# Altium project PDM Mk21 - Mini.PrjPCB
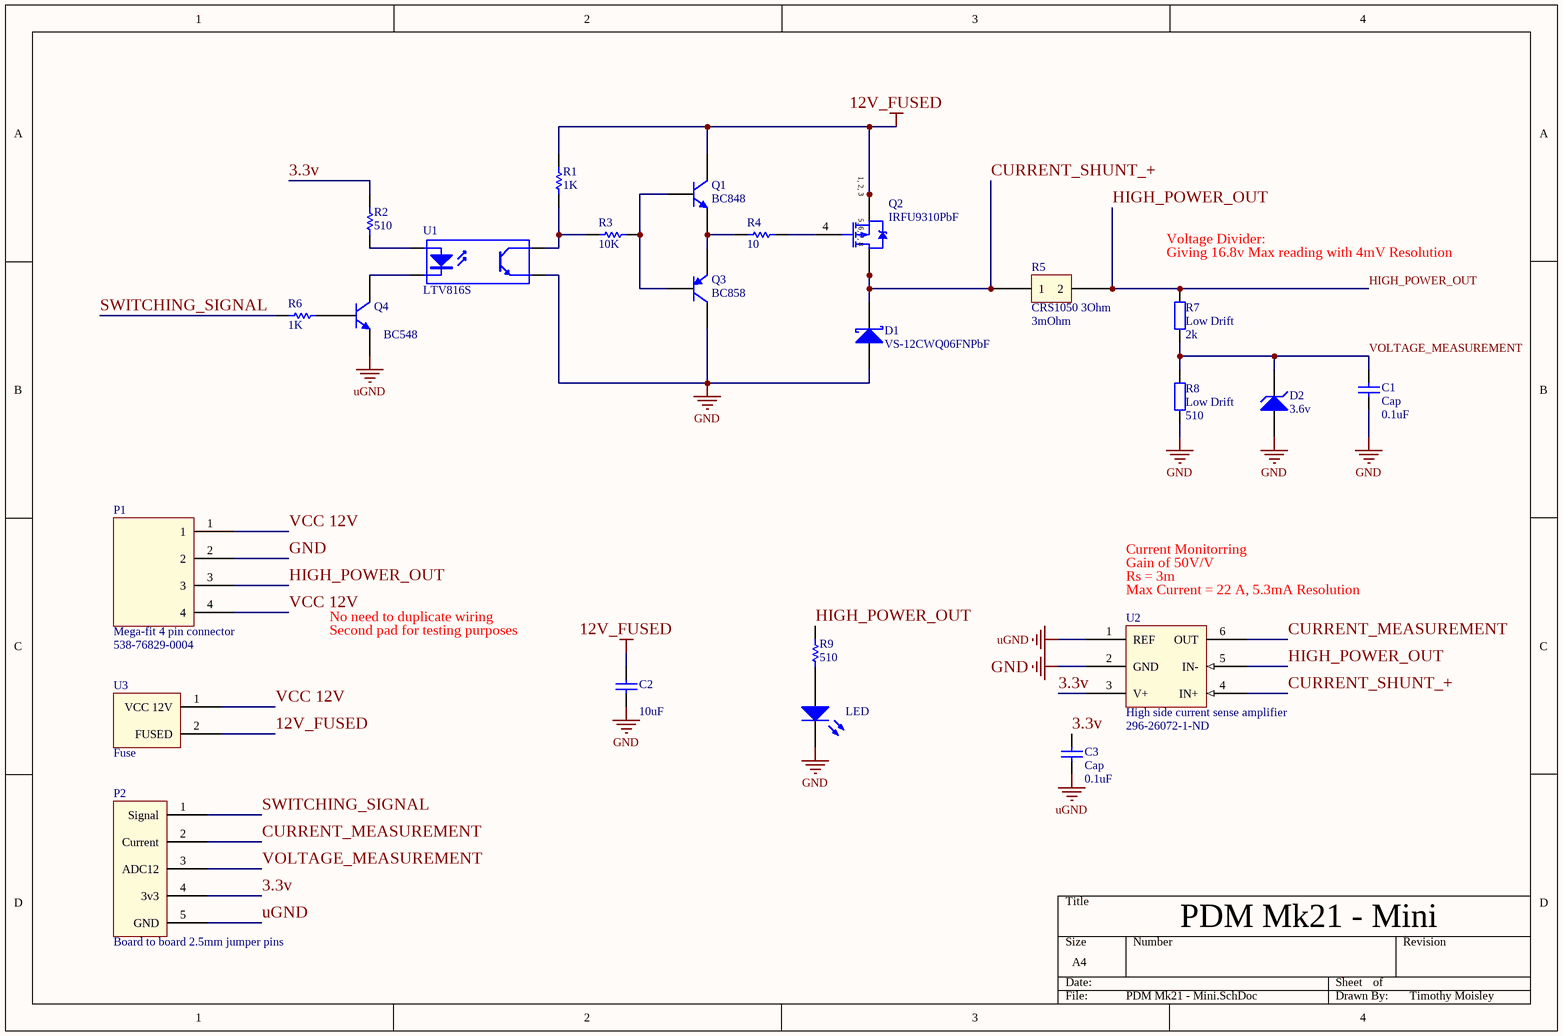
[diagram p0: PDM Mk21 - Mini.SchDoc]
1 sheet, 24 parts. Net scope: global (net labels, ports and power ports of the same name join across sheets).
Board file: PDM Mk 21 - Mini.PcbDoc

## Sheet PDM Mk21 - Mini.SchDoc
size A4

### Parts
C1  Cap  value 0.1uF  [C0805]
C2  value 10uF  [C0805]  (hidden comment: Cap)
C3  Cap  value 0.1uF  [C0805]
D1  VS-12CWQ06FNPbF  [DPAK]
D2  3.6v  [BZX84CxxxET1G]
LED  (no value)  [LED-0]
P1  Mega-fit 4 pin connector  Supplier Part No.: 538-76829-0004  [Mega-fit 4 pin connector]
P2  Board to board 2.5mm jumper pins  [Board-Board Jumper]
Q1  BC848  [SOT-23_L]
Q2  IRFU9310PbF  [SO8_N]
Q3  BC858  [SOT-23_L]
Q4  value BC548  [SOT-23_L]  (hidden comment: NPN)
R1  value 1K  [C0805]  (hidden comment: GND)
R2  value 510  [C0805]  (hidden comment: GND)
R3  value 10K  [C0805]  (hidden comment: GND)
R4  value 10  [C0805]  (hidden comment: Res1)
R5  CRS1050 3Ohm  value 3mOhm  [CRS1050]
R6  value 1K  [C0805]  (hidden comment: IN)
R7  Low Drift  value 2k  [R0805]
R8  Low Drift  value 510  [R0805]
R9  value 510  [C0805]  (hidden comment: GND)
U1  LTV816S  [DIP-4]
U2  High side current sense amplifier  Supplier Part Number: 296-26072-1-ND  [INA212]
U3  Fuse  [Fuse]

### Nets
12V_FUSED: C2.2 Q1.3(C) Q2.1(S) Q2.2(S) Q2.3(S) R1.1 U3.2(FUSED)
GND: C1.1 C2.1 D1.3(A) D2.1(A) LED.2(K) P1.2 Q3.3(C) R8.1 U1.3(E) U2.2(GND)
uGND: C3.1 P2.5(GND) Q4.2(E) U2.1(REF)
3.3v: C3.2 P2.4(3v3) R2.1 U2.3(V+)
CURRENT_MEASUREMENT: P2.2(Current) U2.6(OUT)
CURRENT_SHUNT_+: D1.1(K) Q2.5(D) Q2.6(D) Q2.7(D) Q2.8(D) R5.1 U2.4(IN+)
HIGH_POWER_OUT: P1.3 R5.2 R7.2 R9.1 U2.5(IN-)
SWITCHING_SIGNAL: P2.1(Signal) R6.1
VCC 12V: P1.1 P1.4 U3.1(VCC_12V)
VOLTAGE_MEASUREMENT: C1.2 D2.2(K) P2.3(ADC12) R7.1 R8.2
NetLED_1: LED.1(A) R9.2
NetQ1_1: Q1.1(B) Q3.1(B) R3.2
NetQ1_2: Q1.2(E) Q3.2(E) R4.1
NetQ2_4: Q2.4(G) R4.2
NetQ4_1: Q4.1(B) R6.2
NetQ4_3: Q4.3(C) U1.2(K)
NetR1_2: R1.2 R3.1 U1.4(C)
NetR2_2: R2.2 U1.1(A)

### Notes on the sheet
- Voltage Divider:
- (near R7) Giving 16.8v Max reading with 4mV Resolution
- Gain of 50V/V
- Current Monitorring
- Rs = 3m
- No need to duplicate wiring
- Second pad for testing purposes
- (near U2) Max Current = 22 A, 5.3mA Resolution
- PDM Mk21 - Mini
- Timothy Moisley
- (in symbol IRF7220) 1, 2, 3; 5, 6, 7, 8

### Library data of the parts
C1 C3 = Cap: Capacitor; Published: 8-Jun-2000; LatestRevisionDate: 17-Jul-2002; LatestRevisionNote: Re-released for DXP Platform.; PackageReference: RAD-0.3; Publisher: Altium Limited; PackageDescription: Radial Cap, Thru-Hole; 2 Leads; 0.3 in Pin Spacing
C2 = Cap: Capacitor; Manufacturer part no.: 490-5523-1-ND; Supplier: Digikey; Supplier Part no.: 490-5523-1-ND
D1 = MBR1645: Schottky Rectifier; Note: Terminal 2 is the TAB and is electrically connected to the cathode; Published: 8-Jun-2000; LatestRevisionDate: 17-Jul-2002; LatestRevisionNote: Re-released for DXP Platform.; DatasheetVersion: Dec-1997; PackageVersion: Feb-1998; PackageReference: TO-220AC; Publisher: Altium Limited; PackageDescription: TO, Thru-Hole, Vertical, Heatsink Mounted; 3 In-Line Leads (1 Absent); Pitch 2.54 mm; ComponentLink1Description: Manufacturer Link; ComponentLink1URL: http://www.irf.com/; ComponentLink2Description: Datasheet; ComponentLink2URL: http://www.irf.com/product-info/datasheets/data/mbr1635.pdf
D2 = D Zener: Zener Diode; Published: 8-Jun-2000; LatestRevisionDate: 17-Jul-2002; LatestRevisionNote: Re-released for DXP Platform.; PackageReference: DIODE-0.7; Publisher: Altium Limited; PackageDescription: Diode, Thru-Hole; 2 Leads; 0.7 in Pin Spacing
LED = LED0: Typical INFRARED GaAs LED; Published: 8-Jun-2000; LatestRevisionDate: 08-Jul-2005; LatestRevisionNote: Mech Layer 1 removed.; PackageReference: LED-0; Publisher: Altium Limited; PackageDescription: LED; 2 Leads
P1 = Mega-fit 4 pin connector: MOLEX mega-fit 4 pin connector; Manufacturer Part No.: 76829-0004; Manufacturer: MOLEX; Supplier: Mouser
P2 = Board-Board Jumper
Q1 = BC817-25: NPN General Purpose Amplifier; Published: 8-Jun-2000; LatestRevisionDate: 20-Nov-2009; LatestRevisionNote: IPC-7351 Footprint Added.; DatasheetVersion: 1997; PackageVersion: Sep-1998; PackageReference: SOT-23A; Publisher: Altium Limited; PackageDescription: 3-Pin SOT-23 Package 0.95 mm Pitch, 2.3 mm Lead Span; ComponentLink1Description: Manufacturer Link; ComponentLink1URL: http://www.fairchildsemi.com/; ComponentLink2Description: Discontinuation Notice; ComponentLink2URL: http://www.fairchildsemi.com/obsolete/obs.jsp
Q2 = IRF7220: HEXFET Power MOSFET - International Rectifier; Published: 17-Sep-2003; LatestRevisionDate: 13-Apr-2006; LatestRevisionNote: IPC-7351 Footprint Added.; DatasheetVersion: 16-Jul-1999; PackageVersion: Feb-2001; PackageReference: SO-8; Publisher: Altium Limited; PackageDescription: 8-Pin Plastic Small Outline Integrated Circuit 1.27 mm Pitch; Code_JEDEC: MS-012-AA; Code_IPC: SOIC127P600-8; ComponentLink1Description: Manufacturer Link; ComponentLink1URL: http://www.irf.com/; ComponentLink2Description: Datasheet; ComponentLink2URL: http://www.irf.com/product-info/datasheets/data/irf7220.pdf
Q3 = BC807-16: PNP General Purpose Amplifier; Published: 8-Jun-2000; LatestRevisionDate: 20-Nov-2009; LatestRevisionNote: IPC-7351 Footprint Added.; DatasheetVersion: 1997; PackageVersion: Sep-1998; PackageReference: SOT-23A; Publisher: Altium Limited; PackageDescription: 3-Pin SOT-23 Package 0.95 mm Pitch, 2.3 mm Lead Span; ComponentLink1Description: Manufacturer Link; ComponentLink1URL: http://www.fairchildsemi.com/; ComponentLink2Description: Datasheet; ComponentLink2URL: http://www.fairchildsemi.com/ds/BC%2FBC807.pdf
Q4 = BC817-25: NPN General Purpose Amplifier; Manufacturer part no.: CRS1050 R003; Maunfacturer: On Semi; Supplier: Mouser; Supplier Part no.: BC848BLT1G
R1-R4 R6 R9 = Res1: Resistor; Published: 8-Jun-2000; LatestRevisionDate: 17-Jul-2002; LatestRevisionNote: Re-released for DXP Platform.; PackageReference: AXIAL-0.3; Publisher: Altium Limited; PackageDescription: Axial Device, Thru-Hole; 2 Leads; 0.3 in Pin Spacing
R5 = CSR1050: Current Shunt Resistor; Manufacturer part no.: CRS1050 R003; Maunfacturer: Arcol; Supplier: Mouser; Supplier Part no.: 284-CRS1050R003J100T
R7 R8 = Res2: Resistor; Published: 8-Jun-2000; LatestRevisionDate: 17-Jul-2002; LatestRevisionNote: Re-released for DXP Platform.; PackageReference: AXIAL-0.4; Publisher: Altium Limited; PackageDescription: Axial Device, Thru-Hole; 2 Leads; 0.4 in Pin Spacing
U1 = Optoisolator1: 4-Pin Phototransistor Optocoupler; Manufacturer Part Number: LTV-816S; Part Number: 859-LTV-816S; Published: 24-Mar-1999; PackageReference: PDIP-4 Gull Wing; Publisher: Altium Limited
U2 = INA212: Manufacturer: Texas Instruments; Manufacturer part no.: INA212CIDCKR; Supplier: Digikey